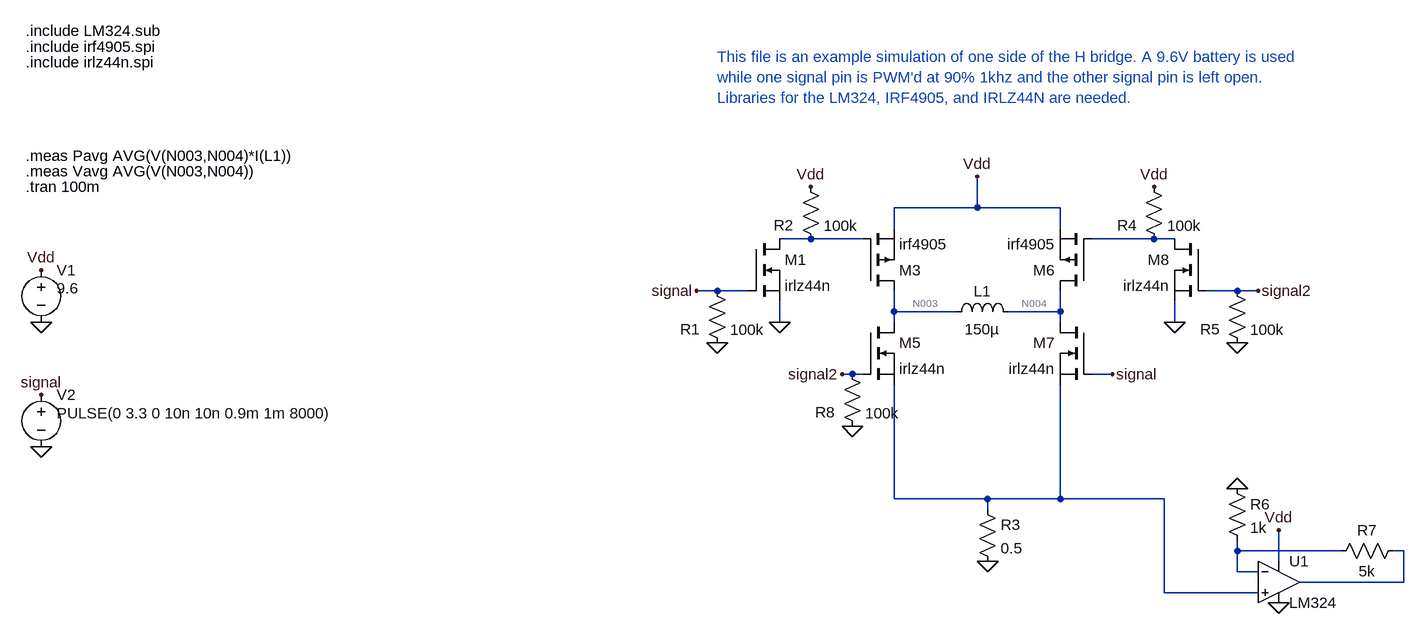
[diagram p0: schematic HBridgeSim.asc]
HBridgeSim.asc, the LTspice schematic file:
Version 4.1
SHEET 1 1736 1124
WIRE 528 496 528 448
WIRE 528 496 400 496
WIRE 656 496 528 496
WIRE 400 528 400 496
WIRE 656 528 656 496
WIRE 272 544 224 544
WIRE 352 544 272 544
WIRE 800 544 704 544
WIRE 832 544 800 544
WIRE 128 624 96 624
WIRE 176 624 128 624
WIRE 928 624 880 624
WIRE 960 624 928 624
WIRE 400 656 400 624
WIRE 496 656 400 656
WIRE 656 656 656 624
WIRE 656 656 576 656
WIRE 224 672 224 640
WIRE 400 672 400 656
WIRE 656 672 656 656
WIRE 832 672 832 640
WIRE 336 752 320 752
WIRE 352 752 336 752
WIRE 736 752 704 752
WIRE 400 944 400 768
WIRE 544 944 400 944
WIRE 656 944 656 768
WIRE 656 944 544 944
WIRE 816 944 656 944
WIRE 544 960 544 944
WIRE 928 1024 928 1008
WIRE 1088 1024 928 1024
WIRE 1184 1024 1168 1024
WIRE 992 1040 992 992
WIRE 928 1056 928 1024
WIRE 960 1056 928 1056
WIRE 1184 1072 1184 1024
WIRE 1184 1072 1024 1072
WIRE 816 1088 816 944
WIRE 960 1088 816 1088
FLAG 224 672 0
FLAG 128 704 0
FLAG 272 464 Vdd
FLAG 528 448 Vdd
FLAG 544 1040 0
FLAG 800 464 Vdd
FLAG 832 672 0
FLAG 928 704 0
FLAG -912 592 Vdd
FLAG -912 672 0
FLAG -912 784 signal
FLAG -912 864 0
FLAG 96 624 signal
FLAG 736 752 signal
FLAG 960 624 signal2
FLAG 320 752 signal2
FLAG 336 832 0
FLAG 928 928 0
FLAG 992 992 Vdd
FLAG 992 1104 0
SYMBOL nmos 176 544 R0
SYMATTR InstName M1
SYMATTR Value irlz44n
SYMATTR Prefix X
SYMBOL pmos 352 624 M180
SYMATTR InstName M3
SYMATTR Value irf4905
SYMATTR Prefix X
SYMBOL res 112 608 R0
WINDOW 0 -41 75 Left 2
SYMATTR InstName R1
SYMATTR Value 100k
SYMBOL res 256 448 R0
WINDOW 0 -41 75 Left 2
SYMATTR InstName R2
SYMATTR Value 100k
SYMBOL nmos 352 672 R0
SYMATTR InstName M5
SYMATTR Value irlz44n
SYMATTR Prefix X
SYMBOL ind 480 672 R270
WINDOW 0 32 56 VTop 2
WINDOW 3 5 56 VBottom 2
SYMATTR InstName L1
SYMATTR Value 150µ
SYMATTR SpiceLine Rser=15
SYMBOL pmos 704 624 R180
SYMATTR InstName M6
SYMATTR Value irf4905
SYMATTR Prefix X
SYMBOL nmos 704 672 M0
SYMATTR InstName M7
SYMATTR Value irlz44n
SYMATTR Prefix X
SYMBOL res 528 944 R0
SYMATTR InstName R3
SYMATTR Value 0.5
SYMBOL res 784 448 R0
WINDOW 0 -41 75 Left 2
SYMATTR InstName R4
SYMATTR Value 100k
SYMBOL nmos 880 544 M0
SYMATTR InstName M8
SYMATTR Value irlz44n
SYMATTR Prefix X
SYMBOL res 912 608 R0
WINDOW 0 -41 75 Left 2
SYMATTR InstName R5
SYMATTR Value 100k
SYMBOL voltage -912 576 R0
WINDOW 3 24 44 Left 2
WINDOW 123 0 0 Left 0
WINDOW 39 0 0 Left 0
SYMATTR Value 9.6
SYMATTR InstName V1
SYMBOL voltage -912 768 R0
WINDOW 3 24 44 Left 2
WINDOW 123 0 0 Left 0
WINDOW 39 0 0 Left 0
SYMATTR Value PULSE(0 3.3 0 10n 10n 0.9m 1m 8000)
SYMATTR InstName V2
SYMBOL res 320 736 R0
WINDOW 0 -41 75 Left 2
SYMATTR InstName R8
SYMATTR Value 100k
SYMBOL OpAmps\\opamp2 992 1008 R0
SYMATTR InstName U1
SYMATTR Value LM324
SYMBOL res 912 912 R0
SYMATTR InstName R6
SYMATTR Value 1k
SYMBOL res 1184 1008 R90
WINDOW 0 0 56 VBottom 2
WINDOW 3 32 56 VTop 2
SYMATTR InstName R7
SYMATTR Value 5k
TEXT -936 248 Left 2 !.include irf4905.spi
TEXT -936 272 Left 2 !.include irlz44n.spi
TEXT -936 464 Left 2 !.tran 100m
TEXT -936 416 Left 2 !.meas Pavg AVG(V(N003,N004)*I(L1))
TEXT -936 440 Left 2 !.meas Vavg AVG(V(N003,N004))
TEXT -936 224 Left 2 !.include LM324.sub
TEXT 128 264 Left 2 ;This file is an example simulation of one side of the H bridge. A 9.6V battery is used\nwhile one signal pin is PWM'd at 90% 1khz and the other signal pin is left open. \nLibraries for the LM324, IRF4905, and IRLZ44N are needed.

The netlist it stands for:
* HBridgeSim.asc
X§M1 N001 signal 0 irlz44n  ; pins D G S
X§M3 N003 N001 Vdd irf4905  ; pins D G S
R1 signal 0 100k
R2 Vdd N001 100k
X§M5 N003 signal2 N005 irlz44n  ; pins D G S
L1 N003 N004 150µ Rser=15
X§M6 N004 N002 Vdd irf4905  ; pins D G S
X§M7 N004 signal N005 irlz44n  ; pins D G S
R3 N005 0 0.5
R4 Vdd N002 100k
X§M8 N002 signal2 0 irlz44n  ; pins D G S
R5 signal2 0 100k
V1 Vdd 0 9.6
V2 signal 0 PULSE(0 3.3 0 10n 10n 0.9m 1m 8000)
R8 signal2 0 100k
X§U1 N005 N006 Vdd 0 N007 LM324  ; pins In+ In- V+ V- OUT
R6 0 N006 1k
R7 N007 N006 5k
.include irf4905.spi
.include irlz44n.spi
.tran 100m
.meas Pavg AVG(V(N003,N004)*I(L1))
.meas Vavg AVG(V(N003,N004))
.include LM324.sub
* This file is an example simulation of one side of the H bridge. A 9.6V battery is used
* while one signal pin is PWM'd at 90% 1khz and the other signal pin is left open.
* Libraries for the LM324, IRF4905, and IRLZ44N are needed.
.backanno
.end